# EasyEDA Pro project 2022江西省焊接赛.eprj

# Schematic Schematic1
Create Date: 2024-03-10; Page Name: P1; Project Name: 2022江西省焊接赛; Schematic Name: Schematic1; Update Date: 2024-03-10; Company: 嘉立创EDA; Page Size: A4; Version: V1.0
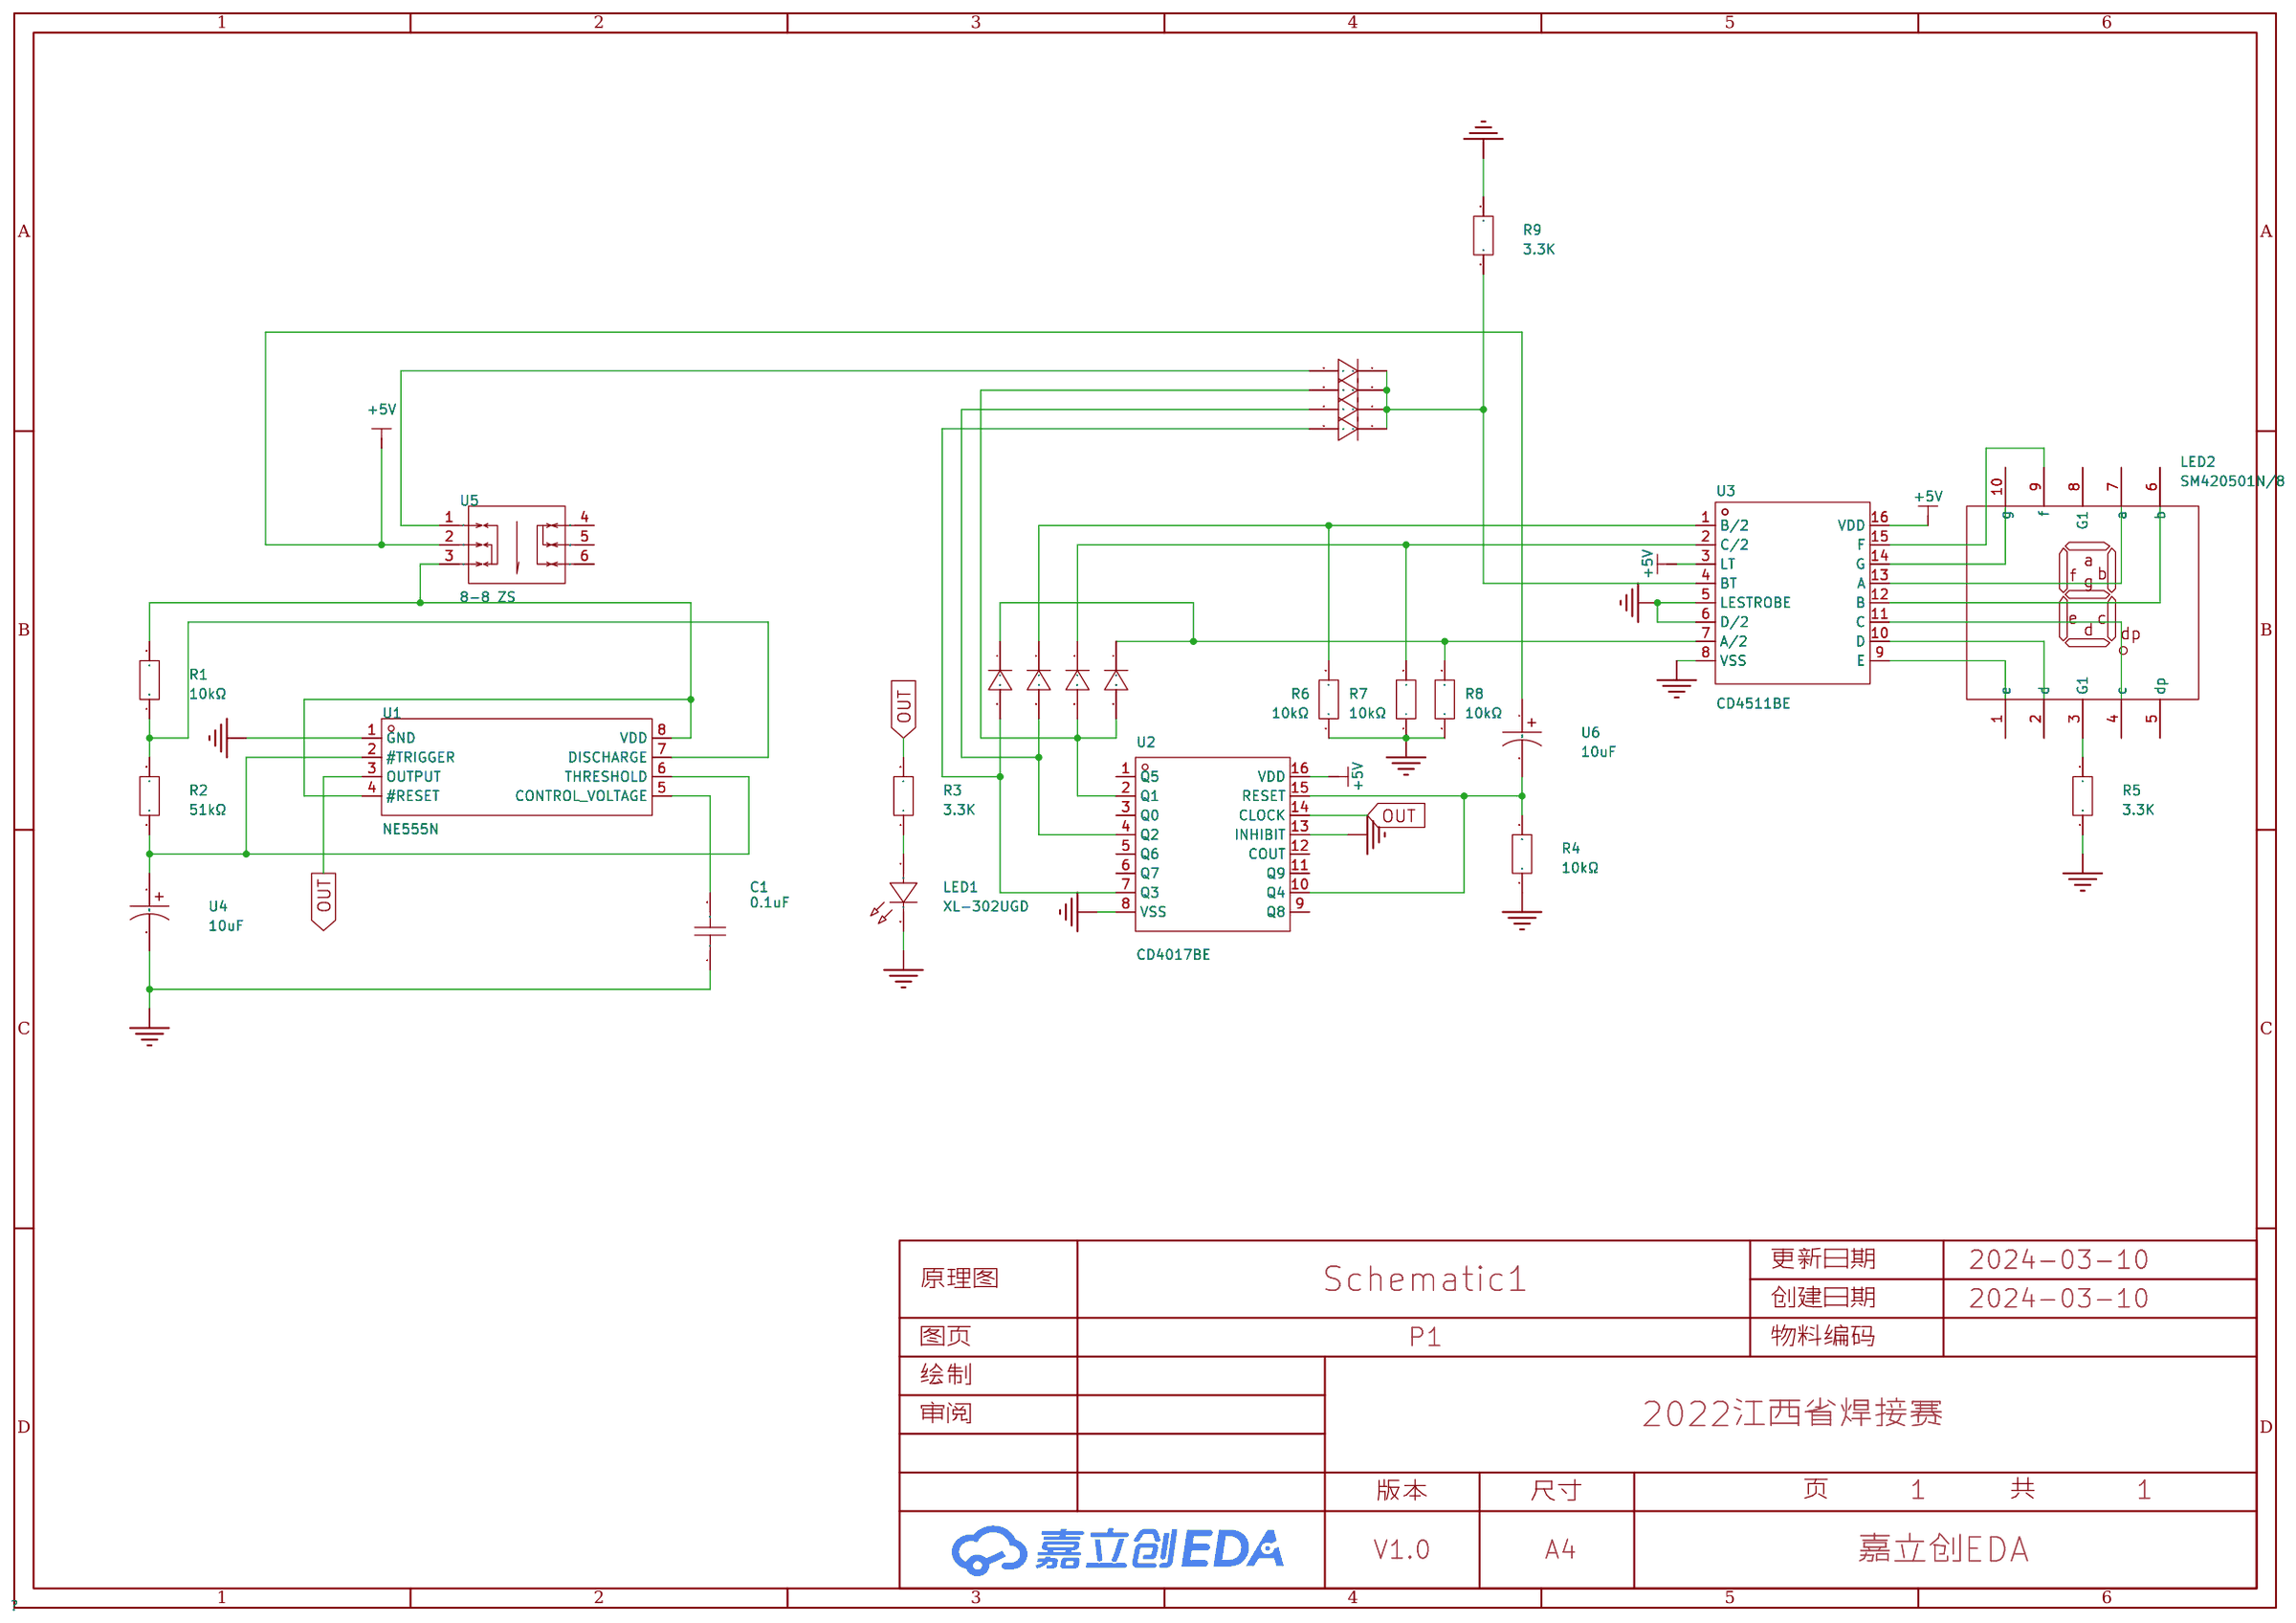
[diagram p0: schematic sheet]

## Parts
C1  0.1uF  [CAP-TH_L5.0-W2.5-P5.08-D0.7]
D1  1N4148  [DO-35_BD2.0-L4.0-P8.0-D0.5-RD]
D2  1N4148  [DO-35_BD2.0-L4.0-P8.0-D0.5-RD]
D3  1N4148  [DO-35_BD2.0-L4.0-P8.0-D0.5-RD]
D4  1N4148  [DO-35_BD2.0-L4.0-P8.0-D0.5-RD]
D5  1N4148  [DO-35_BD2.0-L4.0-P8.0-D0.5-RD]
D6  1N4148  [DO-35_BD2.0-L4.0-P8.0-D0.5-RD]
D7  1N4148  [DO-35_BD2.0-L4.0-P8.0-D0.5-RD]
D8  1N4148  [DO-35_BD2.0-L4.0-P8.0-D0.5-RD]
LED1  XL-302UGD  [LED-TH_BD3.8-P2.54-FD_GREEN]
LED2  SM420501N/8  [LED-SEG-TH_10P-L12.7-W19.0-P2.54-S15.24-BL]
R1  10kΩ  [RES-TH_BD2.3-L6.5-P10.50-D0.5]
R2  51kΩ  [RES-TH_BD2.3-L6.5-P10.50-D0.5]
R3  3.3K  [RES-TH_BD2.3-L6.5-P10.50-D0.5]
R4  10kΩ  [RES-TH_BD2.3-L6.5-P10.50-D0.5]
R5  3.3K  [RES-TH_BD2.3-L6.5-P10.50-D0.5]
R6  10kΩ  [RES-TH_BD2.3-L6.5-P10.50-D0.5]
R7  10kΩ  [RES-TH_BD2.3-L6.5-P10.50-D0.5]
R8  10kΩ  [RES-TH_BD2.3-L6.5-P10.50-D0.5]
R9  3.3K  [RES-TH_BD2.3-L6.5-P10.50-D0.5]
U1  NE555N  [DIP-8_L9.7-W6.4-P2.54-LS7.6-BL]
U2  CD4017BE  [DIP-16_L19.2-W6.6-P2.54-LS7.6-BL]
U3  CD4511BE  [DIP-16_L19.8-W6.5-P2.54-LS7.6-BL]
U4  10uF  [CAP-TH_BD6.3-P2.50-D0.5-FD]
U5  8-8 ZS  [SW-TH_6P-L8.0-W8.0-P2.50]
U6  10uF  [CAP-TH_BD6.3-P2.50-D0.5-FD]

## Library data of the parts
C1 = CC1H104ZC74D3F5O30MN: 容值:100nF;精度:-20%~+80%;额定电压:50V;温度系数:Y5V;; LCSC Part Name: 100nF -20%~+80% 50V; Supplier Part: C254094; Manufacturer: Dersonic(德尔创); Supplier Footprint: 插件,P=5.08mm; JLCPCB Part Class: 扩展库; Datasheet: https://atta.szlcsc.com/upload/public/pdf/source/20200826/C254094_5CB2628DB82B55380EF0EA1FCCF0C073.pdf; Supplier: LCSC; Tolerance: -20%~+80%; Voltage Rated: 50V; Lead Spacing: 5.08mm; Temperature Coefficient: Y5V; φD: 5.3mm; Body Thickness: 2.2mm
D1-D8 = 1N4148_C13769: 二极管配置:-;正向压降(Vf):-;直流反向耐压(Vr):-;平均整流电流(Io):-;; Supplier Part: C13769; Supplier Footprint: DO-35; JLCPCB Part Class: 扩展库; Supplier: LCSC
LED1 = XL-302UGD: 灯头类型:3mm圆形灯头;发光颜色:翠绿色;功率:80mW;正向电流:30mA;主波长:510nm~520nm;透镜颜色:绿色透镜;色温:-;发光角度:50°;载带方式:-;工作温度:-25℃~+85℃;; Supplier Part: C2895476; Manufacturer: XINGLIGHT(成兴光); Supplier Footprint: 插件,D=3mm; JLCPCB Part Class: 扩展库; Datasheet: https://atta.szlcsc.com/upload/public/pdf/source/20240112/A4C1FE2F91E20BD07CDB872CEF78D7A0.pdf; Supplier: LCSC; Lamp Holder Type: 3mm圆形灯头; Emitted Color: 翠绿色; Power Dissipation: 80mW; Forward Current: 30mA; Dominant Wavelength: 510nm~520nm; Peak Wavelength: 525nm; Lens Color: 绿色透镜; Viewing Angle: 50°; Operating Temperature: -25℃~+85℃
LED2 = SM420501N/8: 数码管位数:1位;发光颜色:红色;LED极性:共阴极;数字/字母大小(英寸):0.5;; LCSC Part Name: 1位0.5英寸红色数码管 共阴极; Supplier Part: C252201; Manufacturer: ARKLED(方舟); Supplier Footprint: 插件; JLCPCB Part Class: 扩展库; Datasheet: https://atta.szlcsc.com/upload/public/pdf/source/20180821/C252201_1E0130B228B09D4E21858CDC1E7784AB.pdf; Supplier: LCSC; Number of Characters: 1位; Luminous Color: 红色; LED Polarity: 共阴极; Digit/Alpha Size(inch): 0.5
R1-R9 = MF1/4W-1KΩ±1%T52: 电阻类型:金属膜电阻;阻值:1kΩ;精度:±1%;功率:250mW;温度系数:±200ppm/℃;; LCSC Part Name: 金属膜电阻 1kΩ ±1% 250mW; Supplier Part: C713997; Manufacturer: 华星机电; Supplier Footprint: 插件; JLCPCB Part Class: 扩展库; Datasheet: https://atta.szlcsc.com/upload/public/pdf/source/20200731/C713882_AE8EB1102749D7E4FB4FB13DC898C429.pdf; Supplier: LCSC; Type: 金属膜电阻; Tolerance: ±1%; Power(Watts): 250mW; Temperature Coefficient: ±200ppm/℃
U1 = NE555N: Supplier Part: C510566; Manufacturer: HTC; Supplier Footprint: DIP-8; JLCPCB Part Class: 扩展库; Datasheet: https://atta.szlcsc.com/upload/public/pdf/source/20200407/C510566_727A3F1386E045329F69A94E6D80FA99.pdf; Supplier: LCSC
U2 = CD4017BE: LCSC Part Name: 具有 10 个解码输出的 CMOS 十进制计数器; Supplier Part: C507168; Manufacturer: HGSEMI(华冠); Supplier Footprint: DIP-16; JLCPCB Part Class: 扩展库; Datasheet: https://atta.szlcsc.com/upload/public/pdf/source/20200408/C507168_1EB3A770EB6186DF54EC929FA48E233F.pdf; Supplier: LCSC
U3 = CD4511BE: CD4511B CMOS BCD 到 7 段 LED 锁存解码器驱动器; Supplier Part: C5327; Manufacturer: TI(德州仪器); Supplier Footprint: DIP-16; JLCPCB Part Class: 扩展库; Datasheet: https://www.ti.com/cn/lit/gpn/cd4511b; Supplier: LCSC
U4 U6 = MHT10UF400V87EC0217: 容值:10uF;精度:±20%;额定电压:400V;纹波电流:-;等效串联电阻:-;; LCSC Part Name: 10uF ±20% 400V; Supplier Part: C3034527; Manufacturer: KNSCHA(科尼盛); Supplier Footprint: 插件,D6.3xL16mm; JLCPCB Part Class: 扩展库; Datasheet: https://atta.szlcsc.com/upload/public/pdf/source/20220613/BAC6EB237FF3CCD33B76A42FEFFA13DA.pdf; Supplier: LCSC; Tolerance: ±20%; Rated Voltage: 400V; φD: 6.3mm; L: 16mm
U5 = 8-8 ZS: 电路结构:双刀双掷;自锁/无锁:自锁;安装方式:直插;触点电流:100mA;额定电压 (AC):-;额定电压 (DC):30V;带灯:不带;作用力:180gf;机械寿命:5千次;; LCSC Part Name: 按键开关8x8 自锁高头 180gf; Supplier Part: C5379893; Manufacturer: SHOU HAN(首韩); Supplier Footprint: 插件; JLCPCB Part Class: 扩展库; Datasheet: https://atta.szlcsc.com/upload/public/pdf/source/20230920/344D9C55231D4D6DD37BED301252459B.pdf; Supplier: LCSC; Circuit: 双刀双掷; Self Lock / No Lock: 自锁; Actuator Style: 矩形柱塞; Mounting Style: 直插; Contact Current: 100mA; Voltage Rating (DC): 30V; Insulation Resistance: 100MΩ; Actuator/Cap Color: 蓝色; With Lamp: 不带; Pin Style: PC引脚; Operating Force: 180gf; Operating Temperature: -10℃~+70℃; Mechanical Life: 5千次

## Nets
+5V: U2.16(VDD) U3.3(LT) U3.16(VDD) U5.2 U6.1
GND: C1.1 LED1.2(K) R4.1 R5.1 R6.1 R7.1 R8.1 R9.2 U1.1(GND) U2.8(VSS) U2.13(INHIBIT) U3.5(LESTROBE) U3.6(D/2) U3.8(VSS) U4.2
OUT: R3.2 U1.3(OUTPUT) U2.14(CLOCK)
$1N1114: R1.2 U1.4(#RESET) U1.8(VDD) U5.3
$1N1332: R2.1 U1.2(#TRIGGER) U1.6(THRESHOLD) U4.1
$1N1349: C1.2 U1.5(CONTROL_VOLTAGE)
$1N1363: R1.1 R2.2 U1.7(DISCHARGE)
$1N1431: LED1.1(A) R3.1
$1N1953: R4.2 U2.10(Q4) U2.15(RESET) U6.2
$1N1966: D1.2 U5.1
$1N1976: LED2.7(a) U3.13(A)
$1N1980: LED2.6(b) U3.12(B)
$1N1984: LED2.4(c) U3.11(C)
$1N1988: LED2.2(d) U3.10(D)
$1N1992: LED2.1(e) U3.9(E)
$1N1996: LED2.10(g) U3.14(G)
$1N2000: LED2.9(f) U3.15(F)
$1N2039: LED2.3(G1) R5.2
$1N2401: D4.1 R6.2 U3.1(B/2)
$1N2410: D2.1 R7.2 U3.2(C/2)
$1N2419: D3.1 D5.1 R8.2 U3.7(A/2)
$1N2569: D2.2 D3.2 D6.2 U2.2(Q1)
$1N2579: D4.2 D7.2 U2.4(Q2)
$1N2600: D5.2 D8.2 U2.7(Q3)
$1N2684: D1.1 D6.1 D7.1 D8.1 R9.1 U3.4(BT)

Not connected (* = marked no-connect by the designer): LED2 5(dp) 8(G1); U2 1(Q5) 3(Q0) 5(Q6) 6(Q7) 9(Q8) 11(Q9) 12(COUT); U5 4 5 6

# Board PCB1
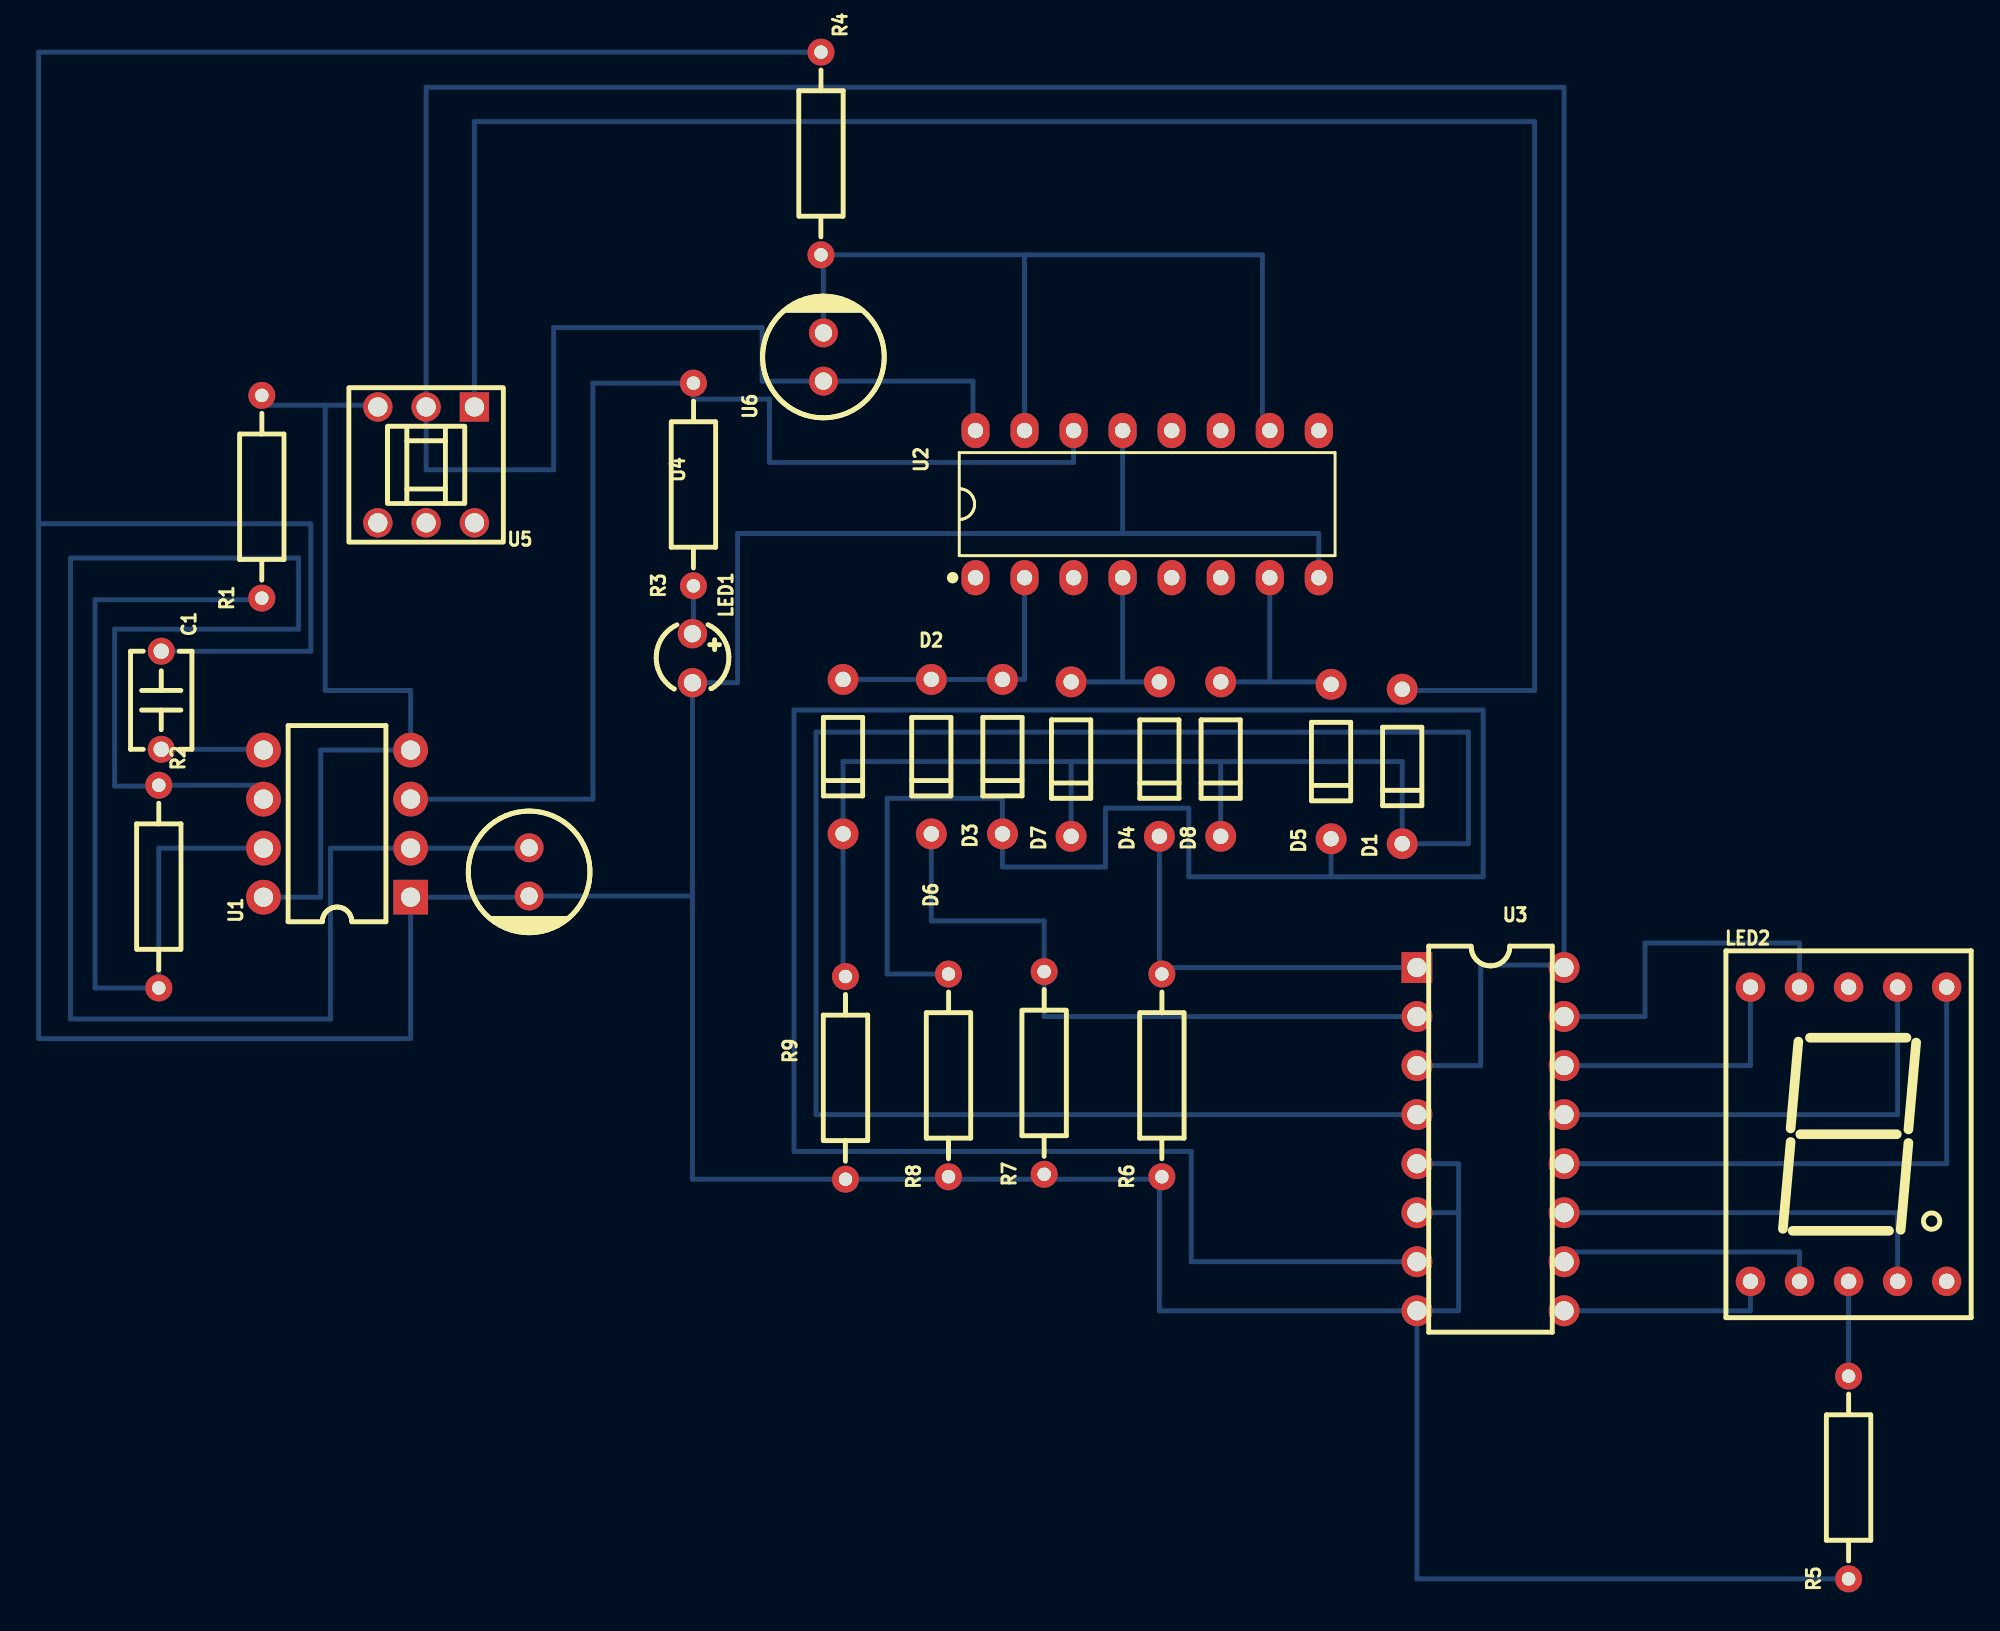
[diagram p1: board, top side]
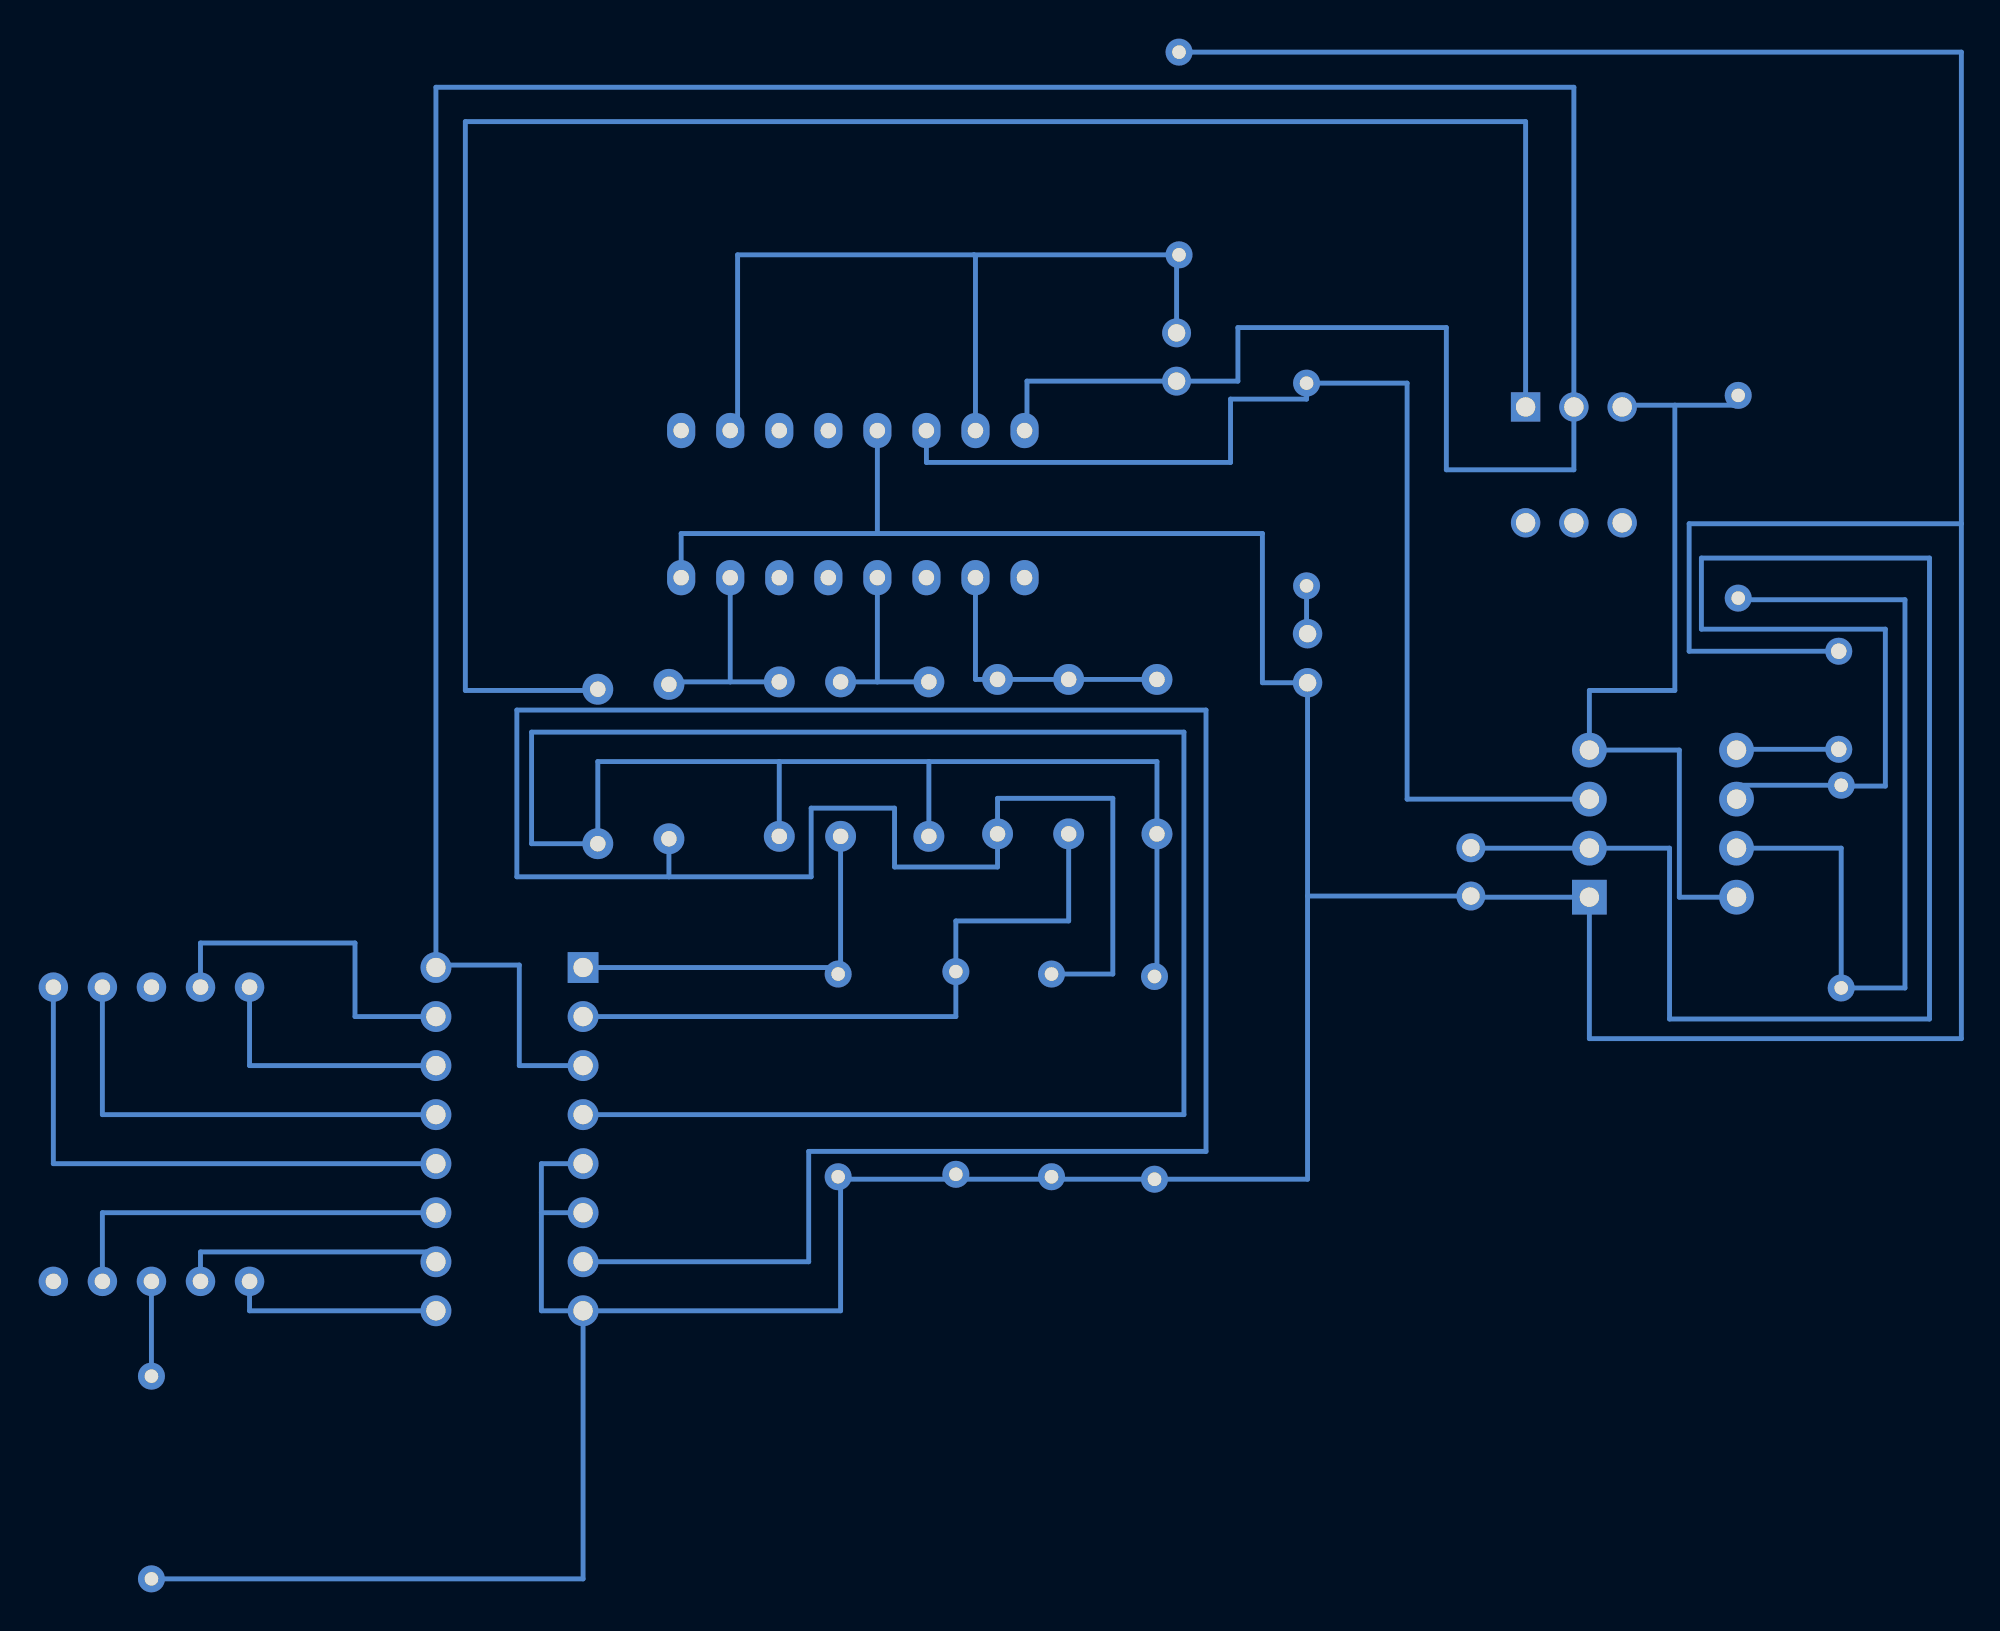
[diagram p2: board, bottom side, seen from below]

No outline. copper layers: Top Layer, Bottom Layer. Coordinates in mm from the lowest, leftmost part position.
Stack: Top Layer 0.035mm / Dielectric1 1.51mm FR4 er 4.5 / Bottom Layer 0.035mm

## Design rules (mm)
template: JLCPCB Capability(Two Layers Board)
spacing copperThickness1oz (default): track to track 0.102, other pairs 0.152 to 0.3
spacing copperThickness2oz: track to track 0.203, other pairs 0.152 to 0.3
track width copperThickness1oz (default): min 0.127, default 0.254, max 2.54
track width copperThickness2oz: min 0.203, default 0.254, max 2.54
differential pair differentialPair (default): width min 0.127, default 0.254, max 2.54; gap min 0.152, default 0.152
via viaSize (default): diameter min 0.5, default 0.61, max 10; hole min 0.3, default 0.305, max 6.3

## Placement (name value [footprint] x y rotation side)
C1  0.1uF  [CAP-TH_L5.0-W2.5-P5.08-D0.7]  0.13 40.26 270 top
D1  1N4148  [DO-35_BD2.0-L4.0-P8.0-D0.5-RD]  64.39 36.83 90 top
D2  1N4148  [DO-35_BD2.0-L4.0-P8.0-D0.5-RD]  40 37.34 90 top
D3  1N4148  [DO-35_BD2.0-L4.0-P8.0-D0.5-RD]  43.69 37.34 90 top
D4  1N4148  [DO-35_BD2.0-L4.0-P8.0-D0.5-RD]  51.82 37.21 90 top
D5  1N4148  [DO-35_BD2.0-L4.0-P8.0-D0.5-RD]  60.71 37.08 90 top
D6  1N4148  [DO-35_BD2.0-L4.0-P8.0-D0.5-RD]  35.43 37.34 90 top
D7  1N4148  [DO-35_BD2.0-L4.0-P8.0-D0.5-RD]  47.24 37.21 90 top
D8  1N4148  [DO-35_BD2.0-L4.0-P8.0-D0.5-RD]  54.99 37.21 90 top
LED1  XL-302UGD  [LED-TH_BD3.8-P2.54-FD_GREEN]  27.63 42.44 270 top
LED2  SM420501N/8  [LED-SEG-TH_10P-L12.7-W19.0-P2.54-S15.24-BL]  87.5 17.78 0 top
R1  10kΩ  [RES-TH_BD2.3-L6.5-P10.50-D0.5]  5.33 50.8 90 top
R2  51kΩ  [RES-TH_BD2.3-L6.5-P10.50-D0.5]  0 30.61 270 top
R3  3.3K  [RES-TH_BD2.3-L6.5-P10.50-D0.5]  27.69 51.44 90 top
R4  10kΩ  [RES-TH_BD2.3-L6.5-P10.50-D0.5]  34.29 68.58 270 top
R5  3.3K  [RES-TH_BD2.3-L6.5-P10.50-D0.5]  87.5 0 90 top
R6  10kΩ  [RES-TH_BD2.3-L6.5-P10.50-D0.5]  51.94 20.83 90 top
R7  10kΩ  [RES-TH_BD2.3-L6.5-P10.50-D0.5]  45.85 20.96 90 top
R8  10kΩ  [RES-TH_BD2.3-L6.5-P10.50-D0.5]  40.89 20.83 90 top
R9  3.3K  [RES-TH_BD2.3-L6.5-P10.50-D0.5]  35.56 20.7 270 top
U1  NE555N  [DIP-8_L9.7-W6.4-P2.54-LS7.6-BL]  9.23 33.87 90 top
U2  CD4017BE  [DIP-16_L19.2-W6.6-P2.54-LS7.6-BL]  51.18 50.42 0 top
U3  CD4511BE  [DIP-16_L19.8-W6.5-P2.54-LS7.6-BL]  68.96 17.53 270 top
U4  10uF  [CAP-TH_BD6.3-P2.50-D0.5-FD]  19.18 31.37 270 top
U5  8-8 ZS  [SW-TH_6P-L8.0-W8.0-P2.50]  13.84 52.45 180 top
U6  10uF  [CAP-TH_BD6.3-P2.50-D0.5-FD]  34.42 58.04 90 top

## Footprints (pads in the part's own frame, mm; a bottom-side part is the same pattern mirrored in y, then rotated)
CAP-TH_BD6.3-P2.50-D0.5-FD
  round 1.5 hole 0.9: 1(-1.25,0) 2(1.25,0)
CAP-TH_L5.0-W2.5-P5.08-D0.7
  round 1.4 hole 0.8: 1(-2.54,0) 2(2.54,0)
DIP-8_L9.7-W6.4-P2.54-LS7.6-BL
  rect 1.8x1.8 hole 1: 1(-3.81,-3.81)
  round 1.8 hole 1: 2(-1.27,-3.81) 3(1.27,-3.81) 4(3.81,-3.81) 5(3.81,3.81) 6(1.27,3.81) 7(-1.27,3.81) 8(-3.81,3.81)
DIP-16_L19.2-W6.6-P2.54-LS7.6-BL
  oval 1.46x1.825 hole 0.8: 1(-8.89,-3.81) 2(-6.35,-3.81) 3(-3.81,-3.81) 4(-1.27,-3.81) 5(1.27,-3.81) 6(3.81,-3.81) 7(6.35,-3.81) 8(8.89,-3.81) 9(8.89,3.81) 10(6.35,3.81) 11(3.81,3.81) 12(1.27,3.81) 13(-1.27,3.81) 14(-3.81,3.81) 15(-6.35,3.81) 16(-8.89,3.81)
DIP-16_L19.8-W6.5-P2.54-LS7.6-BL
  rect 1.6x1.6 hole 1: 1(-8.89,-3.81)
  round 1.6 hole 1: 2(-6.35,-3.81) 3(-3.81,-3.81) 4(-1.27,-3.81) 5(1.27,-3.81) 6(3.81,-3.81) 7(6.35,-3.81) 8(8.89,-3.81) 9(8.89,3.81) 10(6.35,3.81) 11(3.81,3.81) 12(1.27,3.81) 13(-1.27,3.81) 14(-3.81,3.81) 15(-6.35,3.81) 16(-8.89,3.81)
DO-35_BD2.0-L4.0-P8.0-D0.5-RD
  round 1.6 hole 0.8: 1(-4,0) 2(4,0)
LED-SEG-TH_10P-L12.7-W19.0-P2.54-S15.24-BL
  round 1.524 hole 0.8: 1(-5.08,-7.62) 2(-2.54,-7.62) 3(0,-7.62) 4(2.54,-7.62) 5(5.08,-7.62) 6(5.08,7.62) 7(2.54,7.62) 8(0,7.62) 9(-2.54,7.62) 10(-5.08,7.62)
LED-TH_BD3.8-P2.54-FD_GREEN
  round 1.524 hole 0.9: 1(-1.27,0) 2(1.27,0)
RES-TH_BD2.3-L6.5-P10.50-D0.5
  round 1.4 hole 0.7: 1(-5.25,0) 2(5.25,0)
SW-TH_6P-L8.0-W8.0-P2.50
  rect 1.524x1.524 hole 1: 1(-2.5,-3)
  round 1.524 hole 1: 2(0,-3) 3(2.5,-3) 4(-2.5,3) 5(0,3) 6(2.5,3)

## Nets
As in the schematic.

Pads without a net: LED2 5 8; U2 1 3 5 6 9 11 12; U5 4 5 6

## Routing (per net, layer and track width the routed paths; a pad name or vN(x,y) marks a point on that pad's centre or on a via; arc(x,y) is an arc through that point)
+5V: length 178.2
  Bottom Layer w0.254: 42.16,54.23 42.16,56.79 U6.1 31.24,56.79 31.24,59.56 20.45,59.56 20.45,52.2 13.84,52.2 U5.2 13.84,72.01 72.77,72.01 72.77,26.54 ; 72.77,26.54 U3.16 ; 72.77,26.54 68.45,26.54 68.45,21.34 U3.3
GND: length 329.5
  Bottom Layer w0.254: U3.6 67.31,13.72 ; 67.31,13.72 67.31,8.64 65.15,8.64 ; 67.31,13.72 67.31,16.26 U3.5 ; -6.22,49.4 7.87,49.4 7.87,42.8 C1.1 ; -6.22,49.4 -6.22,22.73 13.04,22.73 U1.1 19.18,30.06 U4.2 27.63,30.12 ; -6.22,49.4 -6.22,73.83 R4.1 ; 27.63,30.12 27.63,15.45 R9.2 51.82,15.45 51.82,8.64 65.15,8.64 ; 27.63,30.12 LED1.2 29.97,41.17 29.97,48.9 49.91,48.9 ; U2.13 49.91,48.9 ; 49.91,48.9 60.07,48.9 U2.8 ; R5.1 65.15,-5.25 65.15,8.64
OUT: length 61.6
  Bottom Layer w0.254: U1.3 22.48,35.14 22.48,56.69 R3.2 27.69,55.86 31.62,55.86 31.62,52.58 47.37,52.58 U2.14
$1N1114: length 43.6
  Bottom Layer w0.254: U1.8 8.38,30.06 8.38,37.68 U1.4 13.04,40.77 8.62,40.77 8.62,55.54 ; 8.62,55.54 11.34,55.54 U5.3 ; 8.62,55.54 5.33,55.54
$1N1332: length 98.1
  Bottom Layer w0.254: U1.6 5.42,35.86 R2.1 0,35.81 -2.29,35.81 -2.29,43.94 7.24,43.94 7.24,47.62 -4.57,47.62 -4.57,23.75 8.89,23.75 8.89,32.6 U1.2 19.18,32.6 U4.1
$1N1349: length 5.3
  Bottom Layer w0.254: C1.2 5.42,37.72 U1.5
$1N1363: length 44.9
  Bottom Layer w0.254: 5.33,45.04 4.91,45.47 -3.3,45.47 -3.3,25.36 R2.2 0,32.6 U1.7
$1N1431: length 2.5
  Bottom Layer w0.254: LED1.1 27.69,43.71 R3.1
$1N1953: length 45.1
  Bottom Layer w0.254: 44.91,63.33 44.83,63.25 U2.15 ; 44.91,63.33 57.15,63.33 57.15,54.23 ; 44.91,63.33 34.42,63.33 ; 34.42,63.33 U6.2 ; 34.42,63.33 R4.2
$1N1966: length 106.1
  Bottom Layer w0.254: D1.2 64.39,40.77 71.25,40.77 71.25,70.23 16.34,70.23 U5.1
$1N1976: length 23.9
  Bottom Layer w0.254: LED2.7 90.04,18.8 U3.13
$1N1980: length 29
  Bottom Layer w0.254: U3.12 92.58,16.26 LED2.6
$1N1984: length 20.8
  Bottom Layer w0.254: U3.11 90.04,13.72 LED2.4
$1N1988: length 13.9
  Bottom Layer w0.254: LED2.2 84.96,11.68 73.28,11.68 U3.10
$1N1992: length 11.2
  Bottom Layer w0.254: 72.77,8.64 82.42,8.64 LED2.1
$1N1996: length 13.7
  Bottom Layer w0.254: LED2.10 82.42,21.34 U3.14
$1N2000: length 18.3
  Bottom Layer w0.254: LED2.9 84.96,27.69 76.96,27.69 76.96,23.88 U3.15
$1N2039: length 4.9
  Bottom Layer w0.254: LED2.3 R5.2
$1N2401: length 21.6
  Bottom Layer w0.254: D4.1 51.82,25.7 51.82,26.42 U3.1
$1N2410: length 34.6
  Bottom Layer w0.254: U3.2 45.85,23.88 R7.2 45.85,28.83 40,28.83 D2.1
$1N2419: length 160.4
  Bottom Layer w0.254: R8.2 37.72,26.08 37.72,35.18 43.69,35.18 D3.1 43.69,31.62 49.02,31.62 49.02,34.67 53.34,34.67 53.34,31.12 60.71,31.12 ; 60.71,31.12 68.58,31.12 68.58,39.75 32.89,39.75 32.89,16.89 53.47,16.89 53.47,11.18 U3.7 ; 60.71,31.12 D5.1
$1N2569: length 14.7
  Bottom Layer w0.254: U2.2 44.83,41.34 D3.2 D2.2 D6.2
$1N2579: length 10
  Bottom Layer w0.254: U2.4 49.91,41.21 ; 49.91,41.21 D4.2 ; 49.91,41.21 D7.2
$1N2600: length 11.7
  Bottom Layer w0.254: 57.53,41.21 60.71,41.21 D5.2 ; 57.53,41.21 U2.7 ; 57.53,41.21 D8.2 54.99,40.77
$1N2684: length 146.1
  Bottom Layer w0.254: R9.1 35.43,25.95 D6.1 35.43,37.08 47.24,37.08 ; D7.1 47.24,37.08 ; 47.24,37.08 54.99,37.08 ; 54.99,37.08 64.39,37.08 D1.1 67.82,32.83 67.82,38.61 34.04,38.61 34.04,18.8 U3.4 ; 54.99,37.08 D8.1
